# Altium schematic sheet ADCduinoModule_ADC.SchDoc
size 420 x 297 mm; DocumentNumber: Введите номер платы + Э3; SheetNumber: номер страницы; Format: A3
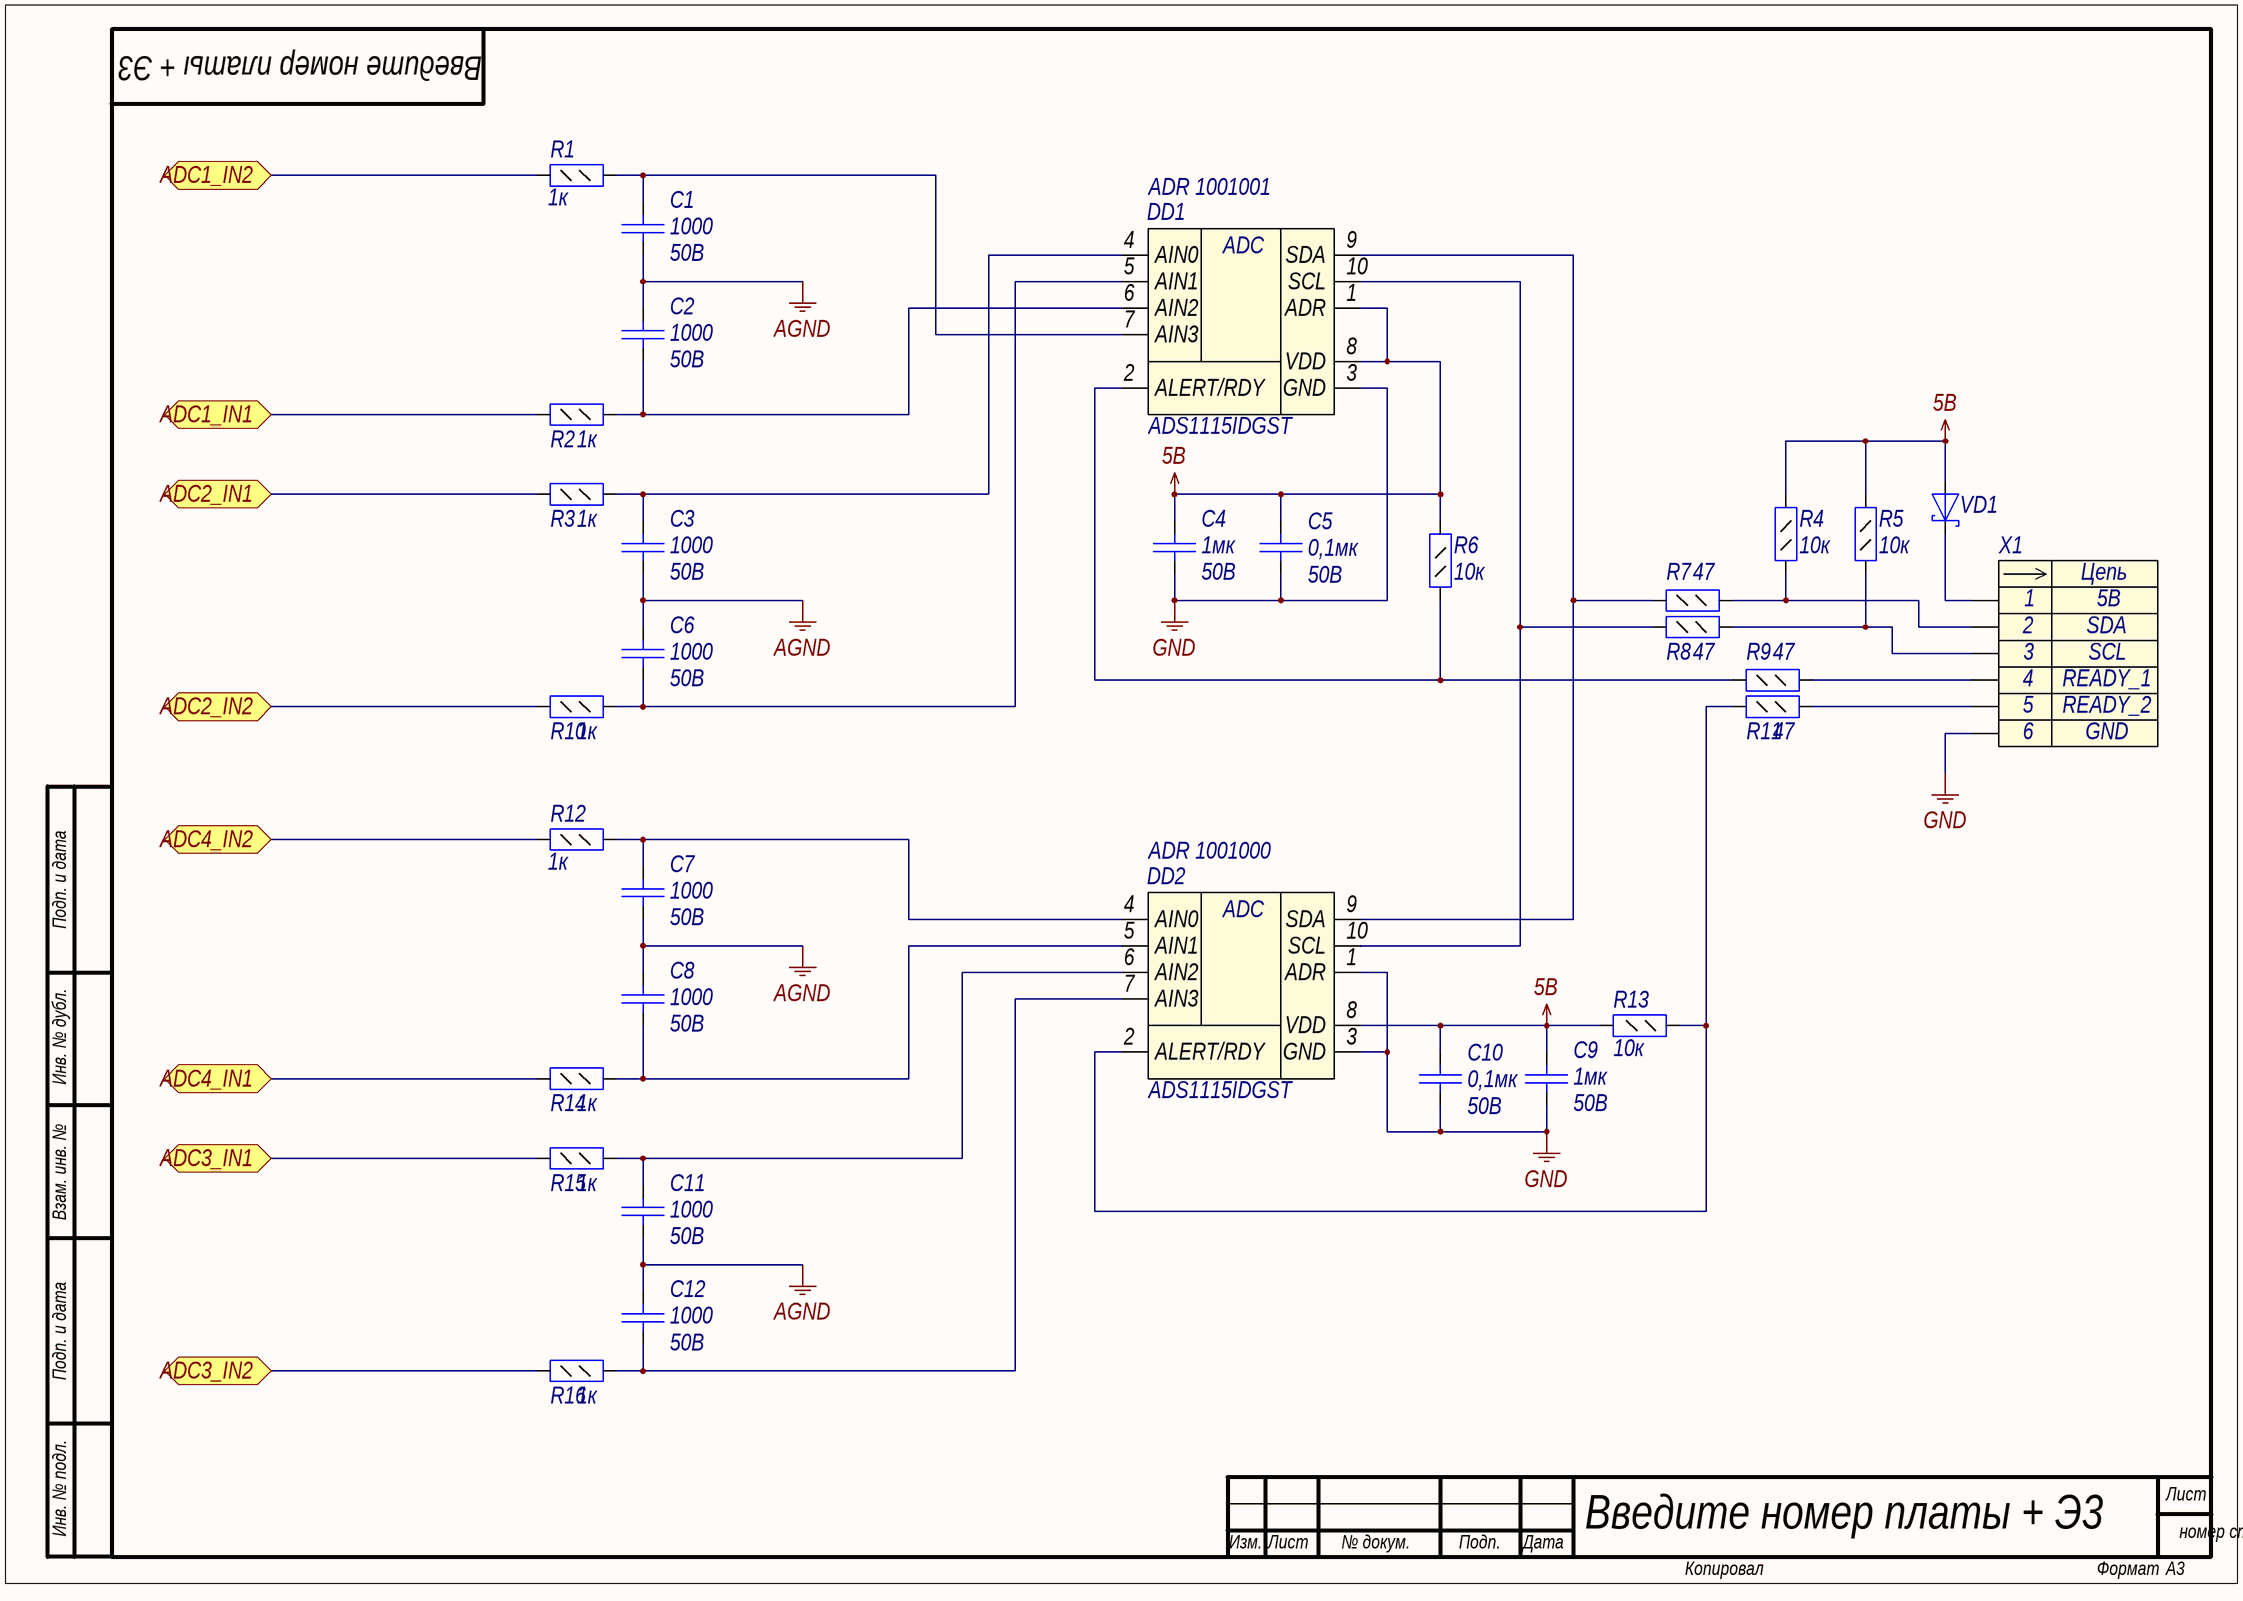
[diagram p0: ADCduinoModule_ADC.SchDoc]

## Parts
C1  value 1000  Voltage: 50В  [C0805]  (hidden comment: Capacitor)
C2  value 1000  Voltage: 50В  [C0805]  (hidden comment: Capacitor)
C3  value 1000  Voltage: 50В  [C0805]  (hidden comment: Capacitor)
C4  value 1мк  Voltage: 50B  [C0805]  (hidden comment: Capacitor)
C5  value 0,1мк  Voltage: 50B  [C0805]  (hidden comment: Capacitor)
C6  value 1000  Voltage: 50В  [C0805]  (hidden comment: Capacitor)
C7  value 1000  Voltage: 50В  [C0805]  (hidden comment: Capacitor)
C8  value 1000  Voltage: 50В  [C0805]  (hidden comment: Capacitor)
C9  value 1мк  Voltage: 50B  [C0805]  (hidden comment: Capacitor)
C10  value 0,1мк  Voltage: 50B  [C0805]  (hidden comment: Capacitor)
C11  value 1000  Voltage: 50В  [C0805]  (hidden comment: Capacitor)
C12  value 1000  Voltage: 50В  [C0805]  (hidden comment: Capacitor)
DD1  ADS1115IDGST  [MSOP10]
DD2  ADS1115IDGST  [MSOP10]
R1  value 1к  [R0805]  (hidden comment: Resistor_0,125Вт)
R2  value 1к  [R0805]  (hidden comment: Resistor_0,125Вт)
R3  value 1к  [R0805]  (hidden comment: Resistor_0,125Вт)
R4  value 10к  [R0805]  (hidden comment: Resistor_0,125Вт)
R5  value 10к  [R0805]  (hidden comment: Resistor_0,125Вт)
R6  value 10к  [R0805]  (hidden comment: Resistor_0,125Вт)
R7  value 47  [R0805]  (hidden comment: Resistor_0,125Вт)
R8  value 47  [R0805]  (hidden comment: Resistor_0,125Вт)
R9  value 47  [R0805]  (hidden comment: Resistor_0,125Вт)
R10  value 1к  [R0805]  (hidden comment: Resistor_0,125Вт)
R11  value 47  [R0805]  (hidden comment: Resistor_0,125Вт)
R12  value 1к  [R0805]  (hidden comment: Resistor_0,125Вт)
R13  value 10к  [R0805]  (hidden comment: Resistor_0,125Вт)
R14  value 1к  [R0805]  (hidden comment: Resistor_0,125Вт)
R15  value 1к  [R0805]  (hidden comment: Resistor_0,125Вт)
R16  value 1к  [R0805]  (hidden comment: Resistor_0,125Вт)
VD1  DiodeSchottky  [SMA]  (value not drawn)
X1  Header_6_plg  [PLS-6]  (value not drawn)

## Ports
ADC1_IN1, ADC1_IN2, ADC2_IN1, ADC2_IN2, ADC3_IN1, ADC3_IN2, ADC4_IN1, ADC4_IN2

## Nets
5B: C4.2 C5.2 C9.2 C10.2 DD1.1(ADR) DD1.8(VDD) DD2.8(VDD) R4.2 R5.2 R6.2 R13.2 VD1.2(A)
AGND: C1.1 C2.2 C3.1 C6.2 C7.1 C8.2 C11.1 C12.2
GND: C4.1 C5.1 C9.1 C10.1 DD1.3(GND) DD2.1(ADR) DD2.3(GND) X1.6
ADC1_IN1: R2.1 ; port ADC1_IN1
ADC1_IN2: R1.1 ; port ADC1_IN2
ADC2_IN1: R3.1 ; port ADC2_IN1
ADC2_IN2: R10.1 ; port ADC2_IN2
ADC3_IN1: R15.1 ; port ADC3_IN1
ADC3_IN2: R16.1 ; port ADC3_IN2
ADC4_IN1: R14.1 ; port ADC4_IN1
ADC4_IN2: R12.1 ; port ADC4_IN2
NetC1_2: C1.2 DD1.7(AIN3) R1.2
NetC2_1: C2.1 DD1.6(AIN2) R2.2
NetC3_2: C3.2 DD1.4(AIN0) R3.2
NetC6_1: C6.1 DD1.5(AIN1) R10.2
NetC7_2: C7.2 DD2.4(AIN0) R12.2
NetC8_1: C8.1 DD2.5(AIN1) R14.2
NetC11_2: C11.2 DD2.6(AIN2) R15.2
NetC12_1: C12.1 DD2.7(AIN3) R16.2
NetDD1_2: DD1.2(ALERT/RDY) R6.1 R9.1
NetDD1_9: DD1.9(SDA) DD2.9(SDA) R7.1
NetDD1_10: DD1.10(SCL) DD2.10(SCL) R8.1
NetDD2_2: DD2.2(ALERT/RDY) R11.1 R13.1
NetR4_1: R4.1 R7.2 X1.2
NetR5_1: R5.1 R8.2 X1.3
NetR9_2: R9.2 X1.4
NetR11_2: R11.2 X1.5
NetVD1_1: VD1.1(K) X1.1

## Notes on the sheet
- (near DD1) ADR 1001001
- (near DD2) ADR 1001000
- Подп. и дата
- Инв. № дубл.
- Взам. инв. №
- Инв. № подл.
- Лист
- Изм.
- № докум.
- Подп.
- Дата
- Копировал
- Формат
- (in symbol connect5) Цепь
- (in symbol interf6) ADC

## Library data of the parts
C1-C3 C6-C8 C11 C12 = cap165: Конденсатор; Part Name: Ceramic; Manufacture: Murata; Part Number: GRM216R71H102K*; id: cap165; TKE: X7R
C4 C9 = cap151: Конденсатор; Part Name: Ceramic; Manufacture: Murata; Part Number: GRM21BR71H105K; id: cap151; TKE: X7R
C5 C10 = cap141: Конденсатор; Part Name: Ceramic; Manufacture: Murata; Part Number: GRM21BR71H104K**; id: cap141; TKE: X7R
DD1 DD2 = interf6: Ultra-Small, Low-Power, 16-Bit  Analog-to-Digital Converter with Internal Reference; Part Name: ADC - I2C; Manufacture: Texas Instruments; Resolution: 16bit; Address: ADDR pin; Sample frequence: 0,86k; Number of Channel: 4; Input channel: 4single 2diff; Type Supply: Single Polar; Current Consumption: 150uA; Power Supply: 2-5.5V; id: interf6; Part Number: ADS1115IDGST
R1-R3 R10 R12 R14-R16 = res73: Резистор; Manufacture: Yageo; Part Number: RC0805FR-071KL; id: res73; Accuracy: 0,01; Part Name: Resistor; Power: 0,125Вт
R4-R6 R13 = res97: Резистор; Manufacture: Yageo; Part Number: RC0805FR-0710KL; id: res97; Accuracy: 0,01; Part Name: Resistor; Power: 0,125Вт
R7-R9 R11 = res41: Резистор; Manufacture: Yageo; Part Number: RC0805FR-0747RL; id: res41; Accuracy: 0,01; Part Name: Resistor; Power: 0,125Вт
VD1 = diode1: Диод Шоттки; Part Number: SK34A; Manufacture: Taiwan Semiconductor; id: diode1; Max Reverse Voltage: 40B; Forward Voltage: 0,55B; Forward Current: 3A; Part Name: Diode Schottky
X1 = connect5: Разъем - 6 конт. вилка; Part Number: DS1021-1*6SF112-B; Manufacture: Ningbo connfly electronic; Contact_1: 5B; Contact_2: SDA; Contact_3: SCL; Contact_4: READY_1; Contact_5: READY_2; Contact_6: GND; Etch: 2,54mm; Part Name: PLS-6; id: connect5